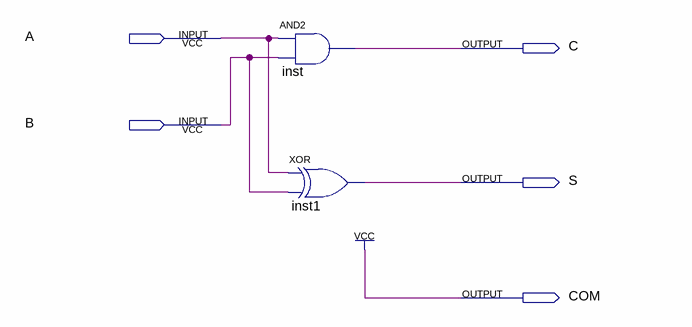
[diagram p0: schematic sheet]
// Quartus schematic ha_add.bdf as structural Verilog: 2 symbols, 5 pins
module ha_add (
  input  A,
  input  B,
  output C,
  output S,
  output COM
);

  and inst (C, A, B);
  xor inst1 (S, A, B);

  assign COM = 1'b1;
endmodule
